# EAGLE design MHBP-LCD-Adapter (EAGLE 7.2.0)
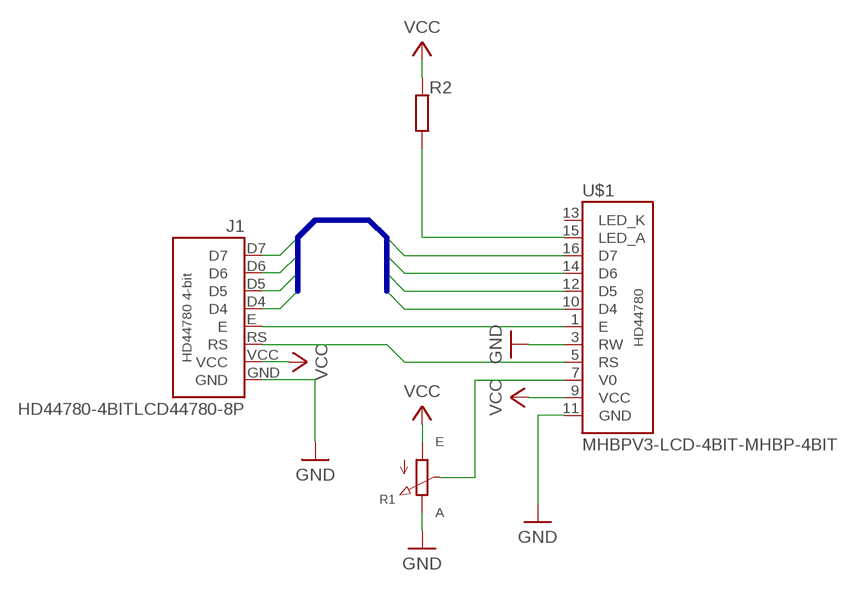
[diagram p0: schematic, sheet 1]

## Parts
J1  HD44780-4BITLCD44780-8P  [CONN-LCD44780]
R1  POT-V  [POT-V]
R2  R0207/12  [0207/12]
U$1  MHBPV3-LCD-4BIT-MHBP-4BIT  [MBHP-LCD-4BIT]

## Nets
D4: J1.D4 U$1.10(D4)
D5: J1.D5 U$1.12(D5)
D6: J1.D6 U$1.14(D6)
D7: J1.D7 U$1.16(D7)
GND: J1.GND R1.E U$1.3(RW) U$1.11(GND)
N$1: R1.S U$1.7(V0)
N$2: J1.RS U$1.5(RS)
N$3: J1.E U$1.1(E)
N$4: R2.1 U$1.15(LED_A)
VCC: J1.VCC R1.A R2.2 U$1.9(VCC)
Unconnected: U$1.13(LED_K)

## Buses
D[4..7]

## Library data of the parts
J1 = pinconn:HD44780-4BIT
R1 = r:POT
R2 = r:R: RESISTOR, European symbol
U$1 = lcd:MHBPV3-LCD-4BIT

## Board
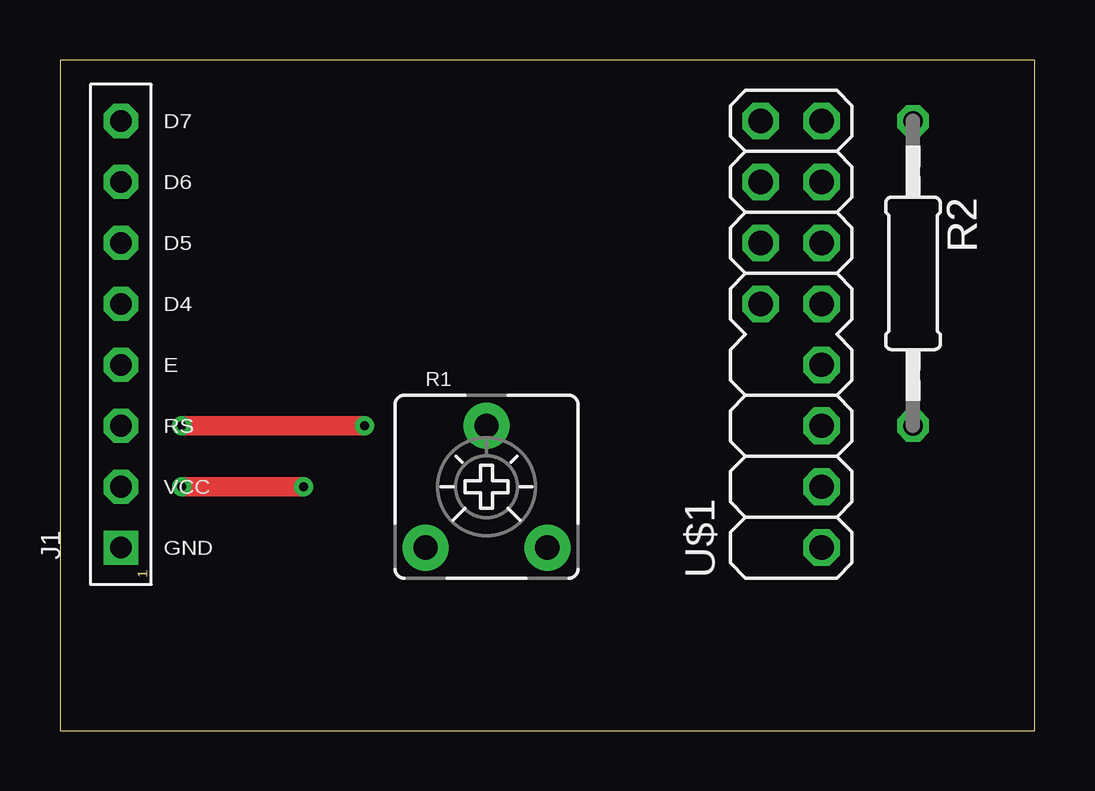
[diagram p1: board, top side]
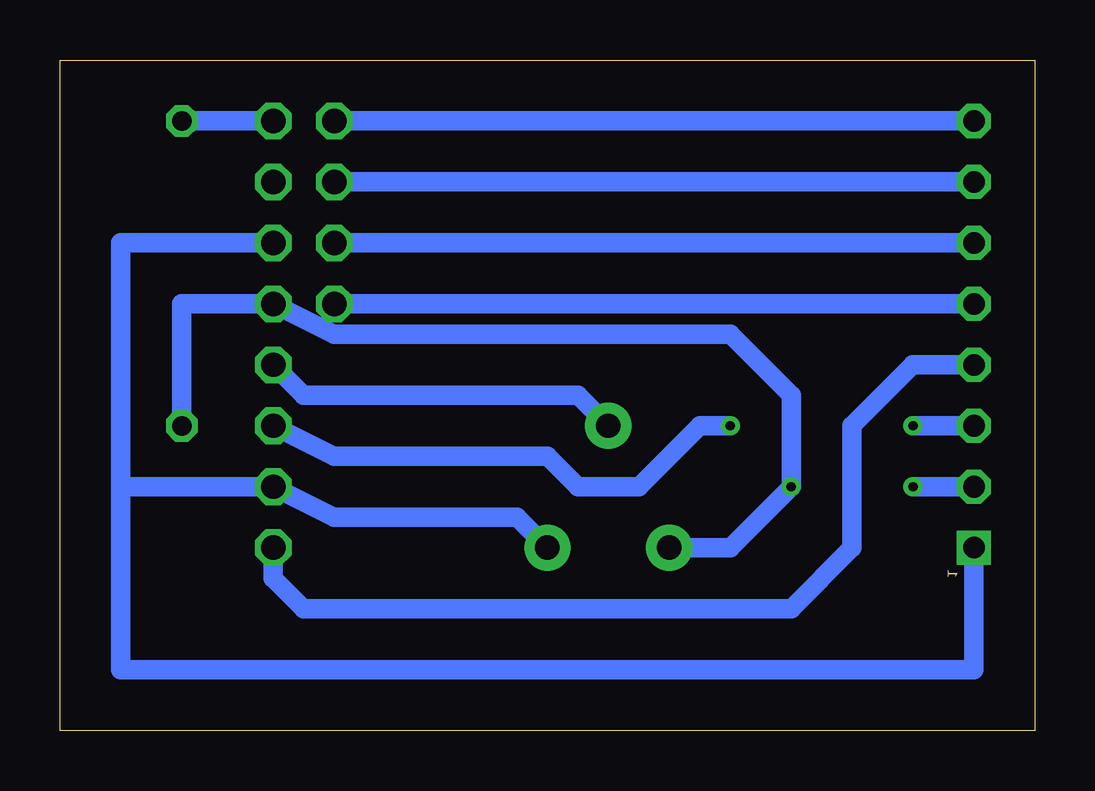
[diagram p2: board, bottom side, seen from below]

Size 40.64 x 27.94 mm. Coordinates in mm from the lower left corner, seen from the top.
Outline: 0,0 40.64,0 40.64,27.94 0,27.94 0,0
Copper layers (1*16): Top 0.035mm / dielectric 1.5mm / Bottom 0.035mm
Design rules "default": minimum track width 10mil, minimum drill 24mil, track to track 8mil, track to pad 8mil, pad to pad 8mil, via to via 8mil, smd to smd 8mil, copper to edge 40mil, drill to drill 8mil, minimum pad ring 10mil, minimum via ring 8mil, stop-mask expansion 4mil, vias tented up to drill 0mil, thermal gap 10mil

### Footprints (pad centres in the part's own frame; a part is rotated, then mirrored left to right if it is on the bottom)
CONN-LCD44780 = drill 0.9 pad 1.422 octagon: D4 0,10.16; D5 0,12.7; D6 0,15.24; D7 0,17.78; E 0,7.62; RS 0,5.08; VCC 0,2.54 | drill 0.9 pad 1.422 square: GND 0,0
POT-V = drill 1.016 pad 1.93: A -2.54,-2.54; E 2.54,-2.54; S 0,2.54
0207/12 = drill 0.813 octagon: 1 -6.35,0; 2 6.35,0
MBHP-LCD-4BIT = drill 1.016 octagon: 1 -8.89,-1.27; 3 -6.35,-1.27; 5 -3.81,-1.27; 7 -1.27,-1.27; 9 1.27,-1.27; 10 1.27,1.27; 11 3.81,-1.27; 12 3.81,1.27; 13 6.35,-1.27; 14 6.35,1.27; 15 8.89,-1.27; 16 8.89,1.27

### Placement (x,y rotation side)
J1  2.54,7.62 0 top
R1  17.78,10.16 0 top
R2  35.56,19.05 270 top
U$1  30.48,16.51 90 top

### Tracks (layer width: path | path; a pad name or v marks a point on that pad's centre or on a via)
D4
  Bottom 0.813: J1.D4 U$1.10
D5
  Bottom 0.813: J1.D5 U$1.12
D6
  Bottom 0.813: U$1.14 J1.D6
D7
  Bottom 0.813: J1.D7 U$1.16
GND
  Bottom 0.813: U$1.11 38.1,20.32 38.1,10.16 | U$1.3 | U$1.3 29.21,8.89 21.59,8.89 R1.E | U$1.3 38.1,10.16 | 38.1,10.16 38.1,2.54 2.54,2.54 J1.GND
N$1
  Bottom 0.813: R1.S 19.05,13.97 30.48,13.97 U$1.7
N$2  (via drill 0.38)
  Top 0.813: v12.7,12.7 v5.08,12.7
  Bottom 0.813: U$1.5 | U$1.5 29.21,11.43 20.32,11.43 19.05,10.16 16.51,10.16 13.97,12.7 v12.7,12.7 | v5.08,12.7 J1.RS
N$3
  Bottom 0.813: U$1.1 31.75,6.35 30.48,5.08 10.16,5.08 7.62,7.62 7.62,12.7 5.08,15.24 J1.E
N$4
  Bottom 0.813: U$1.15 R2.1
VCC  (via drill 0.38)
  Top 0.813: v5.08,10.16 v10.16,10.16
  Bottom 0.813: J1.VCC v5.08,10.16 | R1.A 12.7,7.62 v10.16,10.16 10.16,13.97 12.7,16.51 29.21,16.51 U$1.9 35.56,17.78 R2.2
  other vias: 15.24,7.62 15.24,7.62